# EAGLE design smartstand-headphone-detection-rev-c (EAGLE 7.3.0)
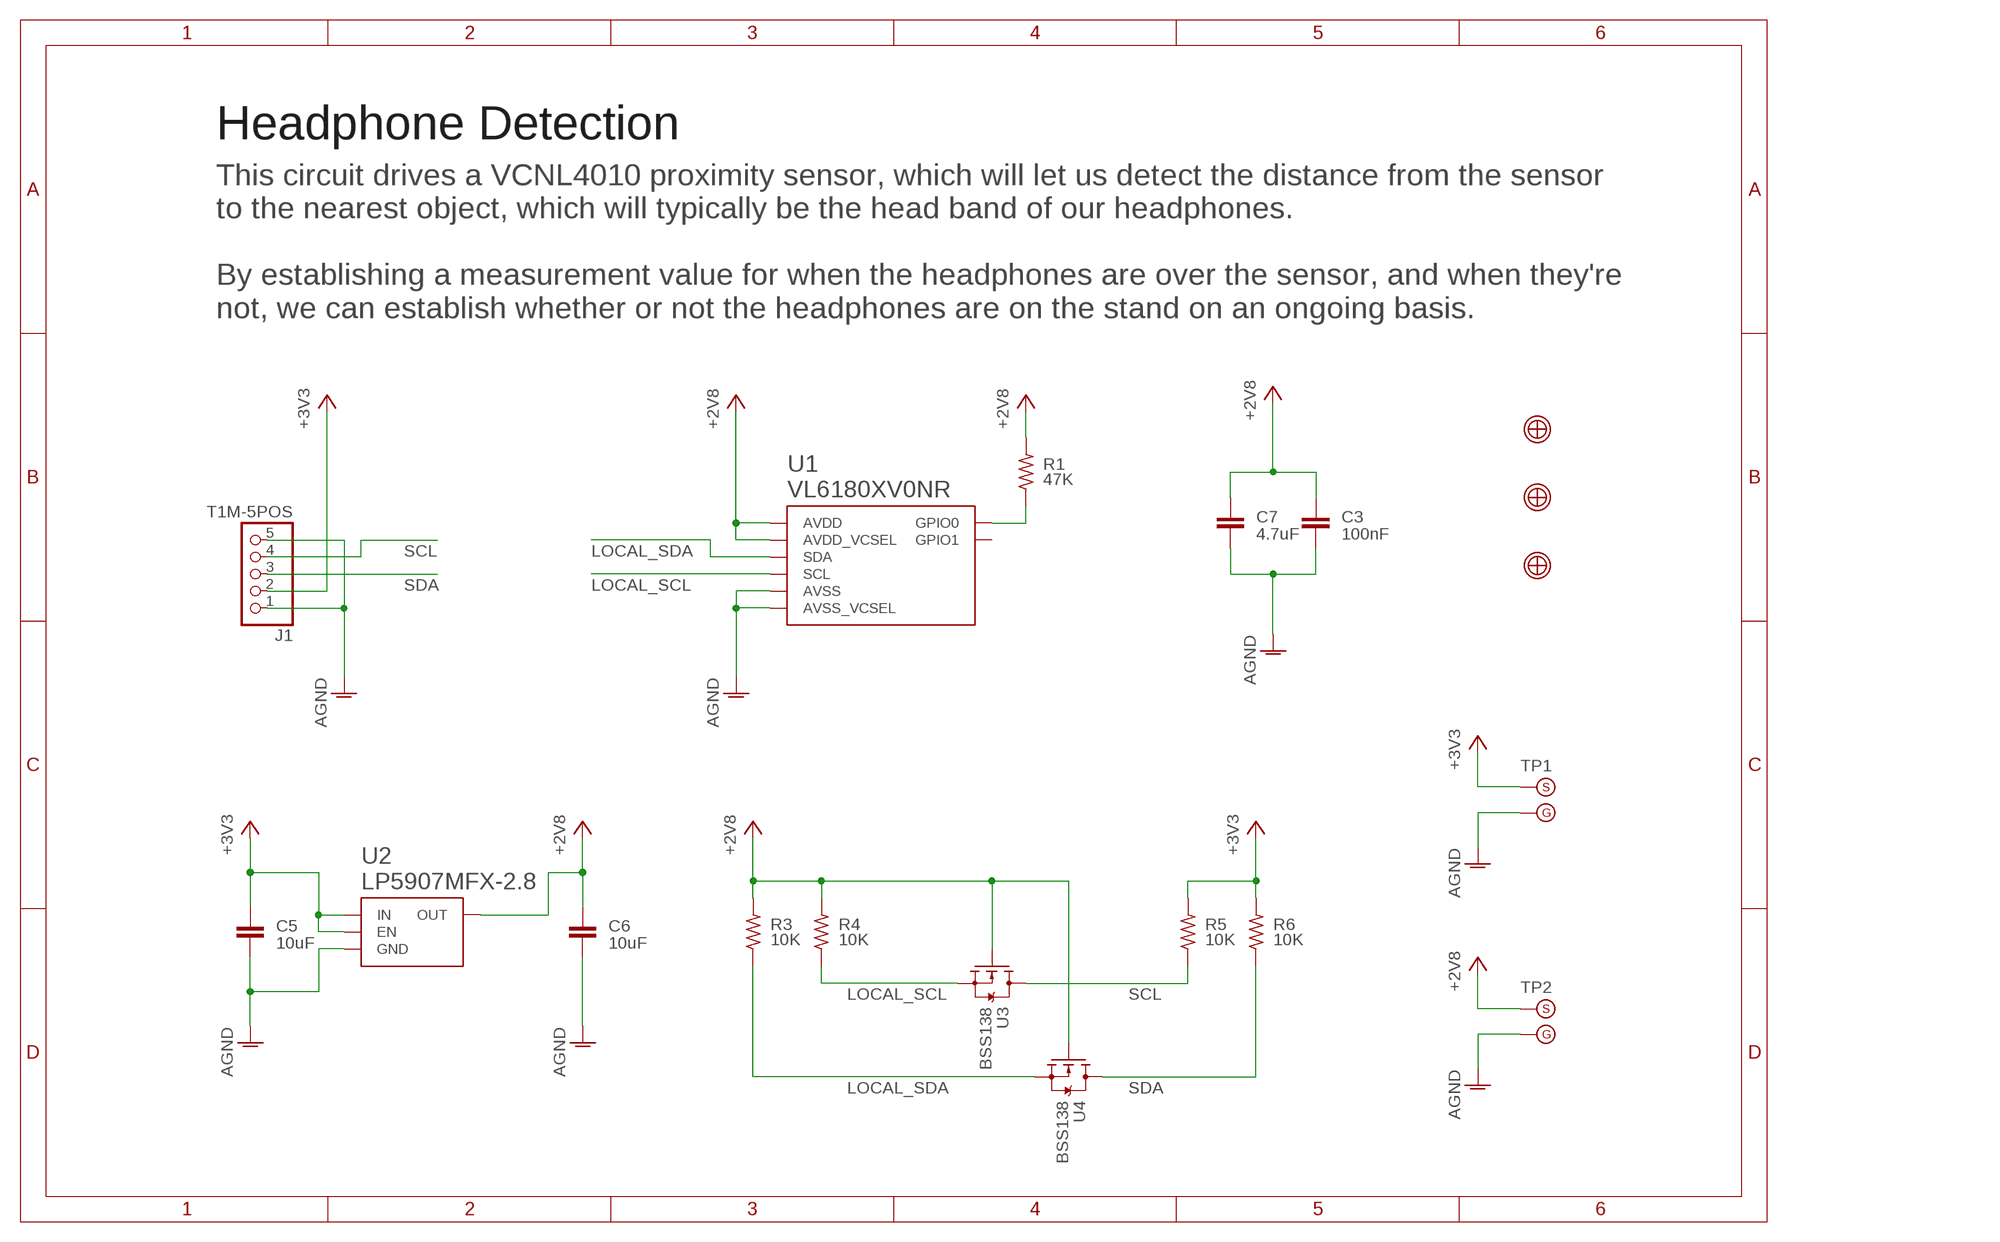
[diagram p0: schematic, sheet 1]
SHEET1 (A4L-NODOC): BOM: EXCLUDE

## Parts
C3  100nF  CAPACITOR-0402  [C0402]
C5  10uF  CAPACITOR-0603  [C0603]
C6  10uF  CAPACITOR-0603  [C0603]
C7  4.7uF  CAPACITOR-0603  [C0603]
J1  T1M-5POS  [T1M-SINGLE-5POS]
R1  47K  RESISTOR-0402  [R0402]
R3  10K  RESISTOR-0402  [R0402]
R4  10K  RESISTOR-0402  [R0402]
R5  10K  RESISTOR-0402  [R0402]
R6  10K  RESISTOR-0402  [R0402]
TP1  TESTPOINT-WITH-GND  [TESTPOINT-1.5-WITH-GND]
TP2  TESTPOINT-WITH-GND  [TESTPOINT-1.5-WITH-GND]
U1  VL6180XV0NR  [VL6180X]
U2  LP5907MFX-2.8  [R-PDSO-G5-DBV]
U3  BSS138  BSS138LT3G  [SOT23]
U4  BSS138  BSS138LT3G  [SOT23]
U$1  FIDUCIAL-1MM  [FIDUCIAL_1MM]
U$2  FIDUCIAL-1MM  [FIDUCIAL_1MM]
U$3  FIDUCIAL-1MM  [FIDUCIAL_1MM]

## Nets
+2V8: C3.1 C6.1 C7.1 R1.2 R3.2 R4.2 TP2.S U1.8(AVDD_VCSEL) U1.10(AVDD) U2.5(OUT) U3.1(G) U4.1(G)
+3V3: C5.1 J1.2 R5.2 R6.2 TP1.S U2.1(IN) U2.3(EN)
AGND: C3.2 C5.2 C6.2 C7.2 J1.1 J1.5 TP1.G TP2.G U1.9(AVSS_VCSEL) U1.12(AVSS) U2.2(GND)
LOCAL_SCL: R4.1 U1.5(SCL) U3.2(S)
LOCAL_SDA: R3.1 U1.6(SDA) U4.2(S)
N$5: R1.1 U1.4(GPIO0)
SCL: J1.4 R5.1 U3.3(D)
SDA: J1.3 R6.1 U4.3(D)
Unconnected: U1.1(GPIO1)

## Notes on the sheet
- Headphone Detection
- This circuit drives a VCNL4010 proximity sensor, which will let us detect the distance from the sensor
  to the nearest object, which will typically be the head band of our headphones.
  
  By establishing a measurement value for when the headphones are over the sensor, and when they're
  not, we can establish whether or not the headphones are on the stand on an ongoing basis.

## Library data of the parts
C3 = passives:CAPACITOR: Capacitor; PN: GRM155R71H104KE14D
C5 C6 = passives:CAPACITOR: Capacitor; PN: C1608X5R0J106M080AB
C7 = passives:CAPACITOR: Capacitor; PN: GRM188R60J475ME19J
J1 = samtec:T1M-5POS: T1M Series - Discrete Wire Headers (1.00 mm / 0.03937"); PN: T1M-05-T-S-RA-TR
R1 = passives:RESISTOR; PN: RC0402FR-0747KL
R3-R6 = passives:RESISTOR; PN: RC0402FR-0710KL
TP1 TP2 = test:TESTPOINT-WITH-GND; BOM: EXCLUDE
U1 = st-microelectronics:VL6180X: Proximity and ambient light sensing (ALS) module; PN: VL6180XV0NR/1
U2 = texas-instruments:LP5907: 250-mA Ultra-Low-Noise, Low-IQ LDO; PN: LP5907MFX-2.8/NOPB
U3 U4 = on-semiconductor:BSS138: MOSFET 50V 200mA N-Channel; PN: BSS138LT3G
U$1-U$3 = fiducials:FIDUCIAL: Fidicual Mark Used by pick-and-place machines to align and orient boards before loading components.; BOM: EXCLUDE

## Board
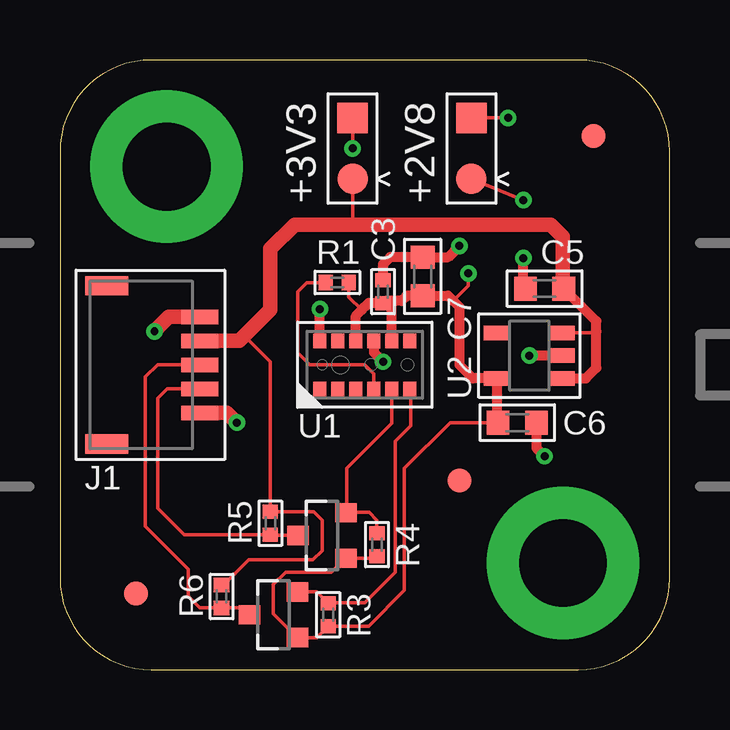
[diagram p1: board, top side]
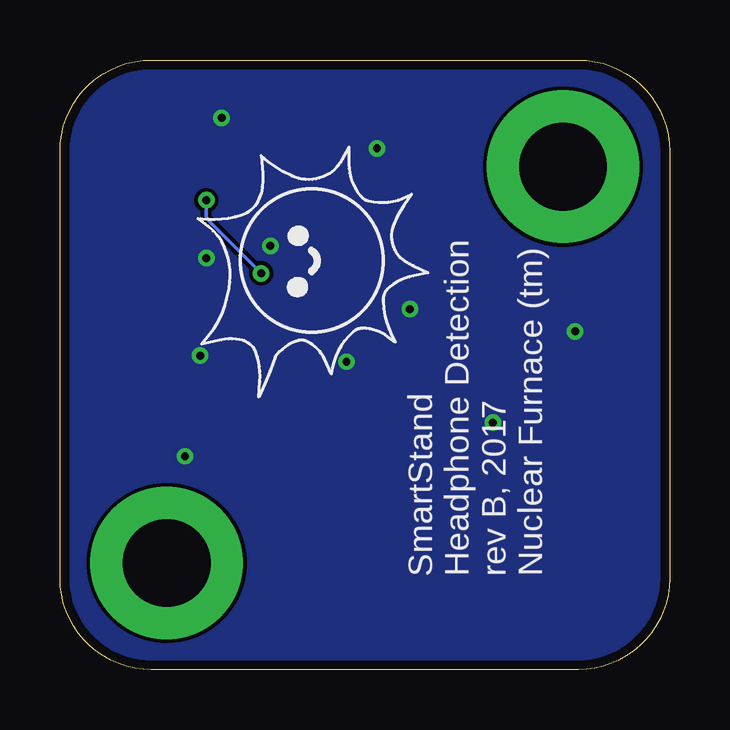
[diagram p2: board, bottom side, seen from below]

Size 25.4 x 25.4 mm. Coordinates in mm from the lower left corner, seen from the top.
Outline: 0,21.59 0,3.81 arc90 3.81,0 21.59,0 arc90 25.4,3.81 25.4,21.59 arc90 21.59,25.4 3.81,25.4 arc90 0,21.59
Copper layers (1*16): Top 0.035559375mm / dielectric 60mil / Bottom 0.035559375mm
Design rules "OSHPark-2Layer": minimum track width 6mil, minimum drill 13mil, track to track 6mil, track to pad 6mil, pad to pad 6mil, via to via 6mil, smd to smd 6mil, copper to edge 15mil, drill to drill 6mil, minimum pad ring 7mil, minimum via ring 7mil, stop-mask expansion 3mil, vias tented up to drill 14mil, thermal gap 10mil

### Footprints (pad centres in the part's own frame; a part is rotated, then mirrored left to right if it is on the bottom)
C0402 = smd 0.59 x 0.64: 1 -0.48,0; 2 0.48,0
C0603 = smd 0.95 x 1: 1 -0.8,0; 2 0.8,0
T1M-SINGLE-5POS = smd 0.6 x 1.55: 1 2,-2.781; 2 1,-2.781; 3 0,-2.781; 4 -1,-2.781; 5 -2,-2.781 | smd 0.8 x 1.8: G1 3.3,1.094; G2 -3.3,1.094
R0402 = smd 0.59 x 0.64: 1 -0.48,0; 2 0.48,0
TESTPOINT-1.5-WITH-GND = smd 1.27 x 1.27: G 1.27,0; S -1.27,0
VL6180X = smd 0.55 x 0.6: 1 -1.875,-1; 2 -1.125,-1; 3 -0.375,-1; 4 0.375,-1; 5 1.125,-1; 6 1.875,-1; 7 1.875,1; 8 1.125,1; 9 0.375,1; 10 -0.375,1; 11 -1.125,1; 12 -1.875,1
R-PDSO-G5-DBV = smd 0.6 x 1.1: 1 -0.95,-1.35; 2 0,-1.35; 3 0.95,-1.35; 4 0.95,1.35; 5 -0.95,1.35
SOT23 = smd 0.8 x 0.9: 1 -0.95,-1; 2 0.95,-1; 3 0,1
FIDUCIAL_1MM = smd 1 x 1: 1 0,0

### Placement (x,y rotation side)
C3  13.46,15.75 90 top
C5  20.19,15.88 180 top
C6  19.05,10.29 0 top
C7  15.11,16.38 90 top
J1  3.05,12.7 90 top
R1  11.56,16.13 0 top
R3  11.18,2.29 270 top
R4  13.21,5.21 270 top
R5  8.76,6.1 90 top
R6  6.73,3.05 90 top
TP1  12.19,21.72 90 top
TP2  17.14,21.72 90 top
U1  12.7,12.7 0 top
U2  19.56,13.08 90 top
U3  10.92,5.59 90 top
U4  8.89,2.29 90 top
U$1  22.23,22.23 0 top
U$2  3.17,3.17 0 top
U$3  16.64,7.87 0 top

### Tracks (layer width: path | path; a pad name or v marks a point on that pad's centre or on a via)
+2V8  (via drill 0.33)
  Top 0.152: R1.2 12.04,15.52 12.57,14.99 | R4.2 13.12,4.64 U3.1 11.88,4.64 11.3,4.06 9.4,4.06 8.89,3.56 8.89,2.34 U4.1 10.71,1.34 R3.2 12.86,1.81 14.35,3.3 14.35,8.38 16.26,10.29 C6.1 | v17.02,16.51 17.02,16 16.38,15.37 | v19.3,19.56 TP2.S
  Top 0.406: U1.10 12.32,14.74 12.57,14.99 12.86,15.27 C3.1 13.56,15.37 13.97,15.37 | 13.97,15.37 14.22,15.37 14.44,15.58 C7.1 16.17,15.58 16.38,15.37 16.64,15.11 16.64,12.7 17.21,12.13 U2.5 18.21,10.33 C6.1 | U1.8 13.82,15.22 13.97,15.37
  Bottom 0.152: v17.02,16.51 19.3,18.8 v19.3,19.56
+3V3
  Top 0.152: R6.2 6.83,3.53 7.87,4.57 10.54,4.57 10.92,4.95 10.92,6.22 10.57,6.58 R5.2 8.76,12.83 7.68,13.91 | U2.3 22.42,14.03 22.35,14.1 | TP1.S 12.19,18.54
  Top 0.406: U2.1 21.91,12.13 22.35,12.57 22.35,14.1 22.35,14.52 C5.1
  Top 0.61: C5.1 20.95,15.91 20.95,18.03 20.45,18.54 12.19,18.54 9.78,18.54 8.76,17.53 8.76,14.99 7.68,13.91 7.48,13.7 J1.2
AGND  (via drill 0.33)
  Top 0.152: TP1.G v12.19,21.72 | TP2.G v18.67,22.99
  Top 0.406: U1.12 v10.82,15.02 | U1.9 13.07,13.21 v13.46,12.83 | C3.2 13.46,16.89 13.75,17.18 C7.2 16.17,17.18 v16.64,17.65 | C6.2 19.85,9.23 v20.19,8.89 | C5.2 19.3,15.88 v19.3,17.14 | U2.2 v19.56,13.08
  Top 0.61: J1.5 6.95,10.7 v7.37,10.29 | J1.1 4.54,14.7 v3.94,14.1
  pour Bottom: 0,21.59 0,3.81 arc90 3.81,0 21.59,0 arc90 25.4,3.81 25.4,21.59 arc90 21.59,25.4 3.81,25.4 arc90
LOCAL_SCL
  Top 0.152: U1.5 13.82,10.27 11.94,8.38 11.94,6.55 | 11.94,6.55 U3.2 | 11.94,6.55 12.88,6.55 13.21,6.22 R4.1
LOCAL_SDA
  Top 0.152: U4.2 10.71,3.24 R3.1 11.2,2.79 12.7,2.79 13.97,4.06 13.97,9.53 14.61,10.16 14.61,11.67 U1.6
N$1  (via drill 3.66 pad 6.35)
  other vias: 20.95,4.45
N$2  (via drill 3.66 pad 6.35)
  other vias: 4.45,20.95
N$5
  Top 0.152: U1.4 13.08,12.32 12.7,12.7 10.41,12.7 9.91,13.21 9.91,15.75 10.29,16.13 R1.1
SCL
  Top 0.152: U3.3 8.79,5.59 R5.1 5.18,5.62 4.06,6.73 4.06,11.3 4.46,11.7 J1.4
SDA
  Top 0.152: U4.3 7.61,2.57 R6.1 5.81,2.57 5.33,3.05 5.33,4.19 3.56,5.97 3.56,12.19 4.06,12.7 J1.3

### Text on the board
tNames: +3V3 | +2V8
bNames: SmartStand / Headphone Detection / rev B, 2017 / Nuclear Furnace (tm)